# EAGLE schematic lid_board (EAGLE 8.2.0)
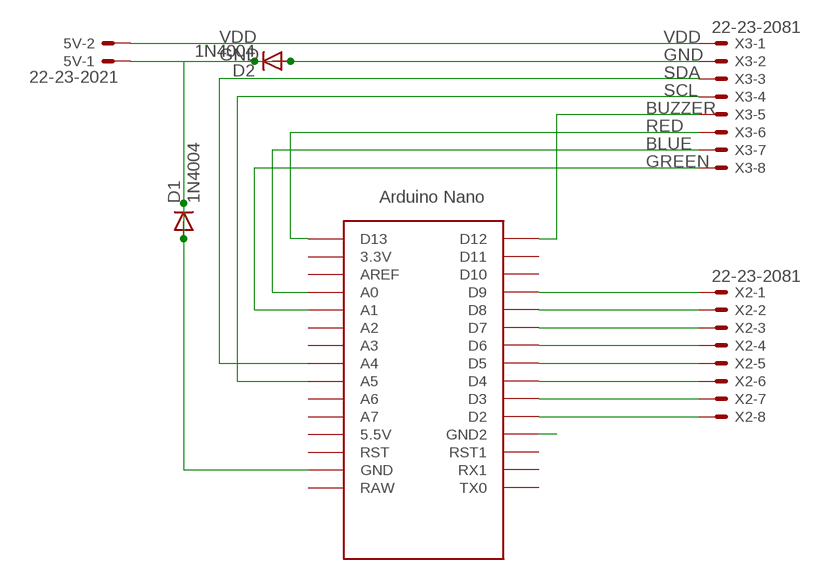
[diagram p0: schematic, sheet 1]

## Parts
5V  22-23-2021  [22-23-2021]
D1  1N4004  [DO41-10]
D2  1N4004  [DO41-10]
U$1  NANO  [NANO]
X2  22-23-2081  [22-23-2081]
X3  22-23-2081  [22-23-2081]

## Nets
BLUE: U$1.A0 X3.7
BUZZER: U$1.D12 X3.5
GND: 5V.1 D1.A D1.C D2.A D2.C U$1.GND X3.2
GREEN: U$1.A1 X3.8
N$1: U$1.D9 X2.1
N$2: U$1.D8 X2.2
N$3: U$1.D7 X2.3
N$4: U$1.D6 X2.4
N$5: U$1.D5 X2.5
N$6: U$1.D4 X2.6
N$7: U$1.D3 X2.7
N$8: U$1.D2 X2.8
N$11: U$1.GND1(GND2)
RED: U$1.D13 X3.6
SCL: U$1.A5 X3.4
SDA: U$1.A4 X3.3
VDD: 5V.2 X3.1
Unconnected: U$1.3.3V U$1.5V(5.5V) U$1.A2 U$1.A3 U$1.A6 U$1.A7 U$1.AREF U$1.D10 U$1.D11 U$1.ICSP1 U$1.ICSP2 U$1.ICSP3 U$1.ICSP4 U$1.ICSP5 U$1.ICSP6 U$1.RAW U$1.RST U$1.RST1 U$1.RX1 U$1.TX0

## Library data of the parts
5V = con-molex:22-23-2021: .100" (2.54mm) Center Header - 2 Pin; MF: MOLEX; MPN: 22-23-2021; OC_FARNELL: 1462926; OC_NEWARK: 25C3832
D1 D2 = adafruit:1N4004: DIODE General purpose 1N400x type rectifier (With bigger pads) http://www.ladyada.net/library/pcb/eaglelibrary.html
U$1 = Arduino-clone:NANO: Arduino Nano
X2 X3 = con-molex:22-23-2081: .100" (2.54mm) Center Header - 8 Pin; MF: MOLEX; MPN: 22-23-2081; OC_FARNELL: 1756826; OC_NEWARK: 01C7592